# Altium schematic sheet temp_lm35.SchDoc
size A4; Engineer: Amir Hossein Jobeiri; Organization: Simaran; SheetNumber: 12; SheetTotal: 24
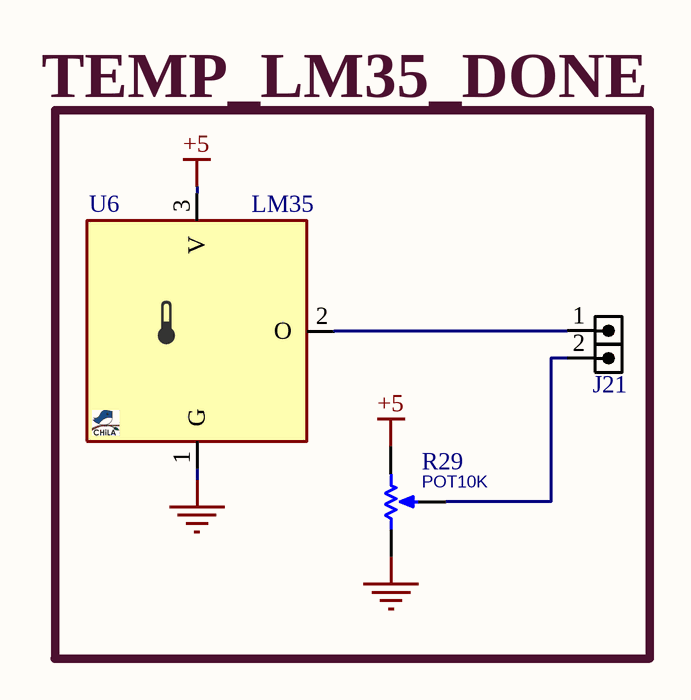
[diagram p0: temp_lm35.SchDoc]

## Parts
J21  HDRM2  [HDR_M_1X2]  (value not drawn)
R29  POT10K  [POT_3296W]
U6  LM35  [TO92_3]

## Nets
+5: R29.3(BOT) U6.3(V)
GND: R29.1(TOP) U6.1(G)
NetJ21_1: J21.1 U6.2(O)
NetJ21_2: J21.2 R29.2(TAP)

## Notes on the sheet
- (near U6) TEMP_LM35_DONE

## Library data of the parts
J21 = HDR_M_1X2: CONN, HEADER, Male, pitch: 2.54mm, 2POS; VALUE: HDRM2
R29 = RES_THD_POT_3296W: RESISTOR, THD, Potentiometer; VALUE: POT10K
U6 = TMP_LM35_TO92: SENSOR, TEMP, ANALOG, -55~150oC, 4~20Vcc, Out 0mV + 10mV/oC; MANF_P#: LM35CZ, LM35CAZ or LM35DZ; MANF: TI; PARAM: 0.5°C Accuracy, 10mV/oC, -55~150oC; PARAM2: 4~20Vcc; PRICE: 7$; VALUE: LM35